# EAGLE schematic Roboteq_Board_V1.1 (EAGLE 9.6.2)
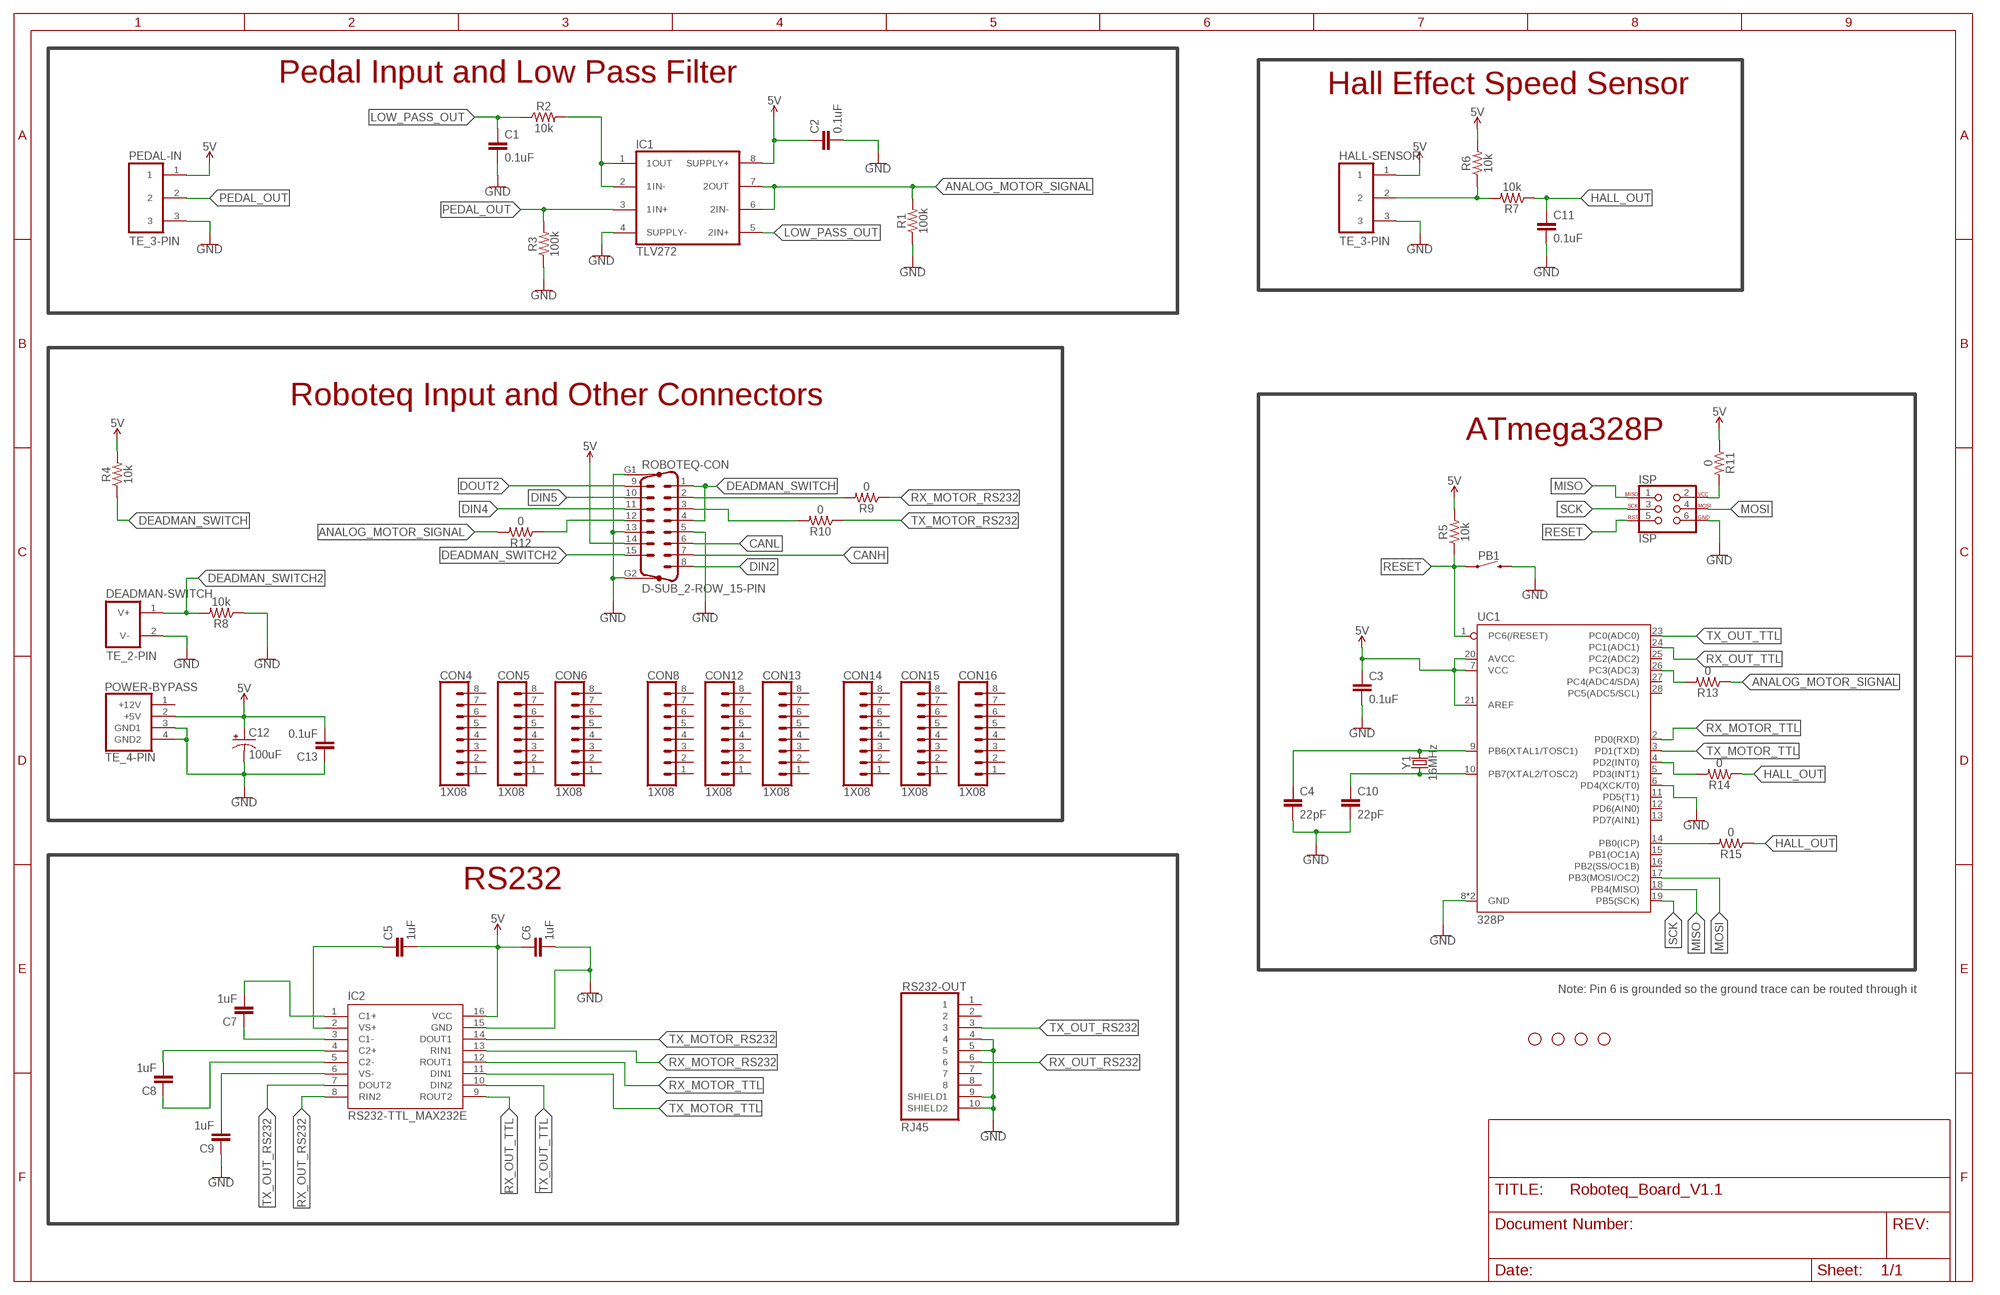
[diagram p0: schematic, sheet 1]

## Parts
C1  0.1uF  CAPACITOR_CERAMIC_THROUGH-HOLE  [CAP-PTH-5MM]
C2  0.1uF  CAPACITOR_CERAMIC_THROUGH-HOLE  [CAP-PTH-5MM]
C3  0.1uF  CAPACITOR_CERAMIC_THROUGH-HOLE  [CAP-PTH-5MM]
C4  22pF  CAPACITOR_CERAMIC_THROUGH-HOLE  [CAP-PTH-5MM]
C5  1uF  CAPACITOR_CERAMIC_THROUGH-HOLE  [CAP-PTH-5MM]
C6  1uF  CAPACITOR_CERAMIC_THROUGH-HOLE  [CAP-PTH-5MM]
C7  1uF  CAPACITOR_CERAMIC_THROUGH-HOLE  [CAP-PTH-5MM]
C8  1uF  CAPACITOR_CERAMIC_THROUGH-HOLE  [CAP-PTH-5MM]
C9  1uF  CAPACITOR_CERAMIC_THROUGH-HOLE  [CAP-PTH-5MM]
C10  22pF  CAPACITOR_CERAMIC_THROUGH-HOLE  [CAP-PTH-5MM]
C11  0.1uF  CAPACITOR_CERAMIC_THROUGH-HOLE  [CAP-PTH-5MM]
C12  100uF  CAPACITOR_ELECTROLYTIC_100UF  [CAPACITOR_100UF_50V]
C13  0.1uF  CAPACITOR_CERAMIC_THROUGH-HOLE  [CAP-PTH-5MM]
CON4  1X08  [1X08]
CON5  1X08  [1X08]
CON6  1X08  [1X08]
CON8  1X08  [1X08]
CON12  1X08  [1X08]
CON13  1X08  [1X08]
CON14  1X08  [1X08]
CON15  1X08  [1X08]
CON16  1X08  [1X08]
DEADMAN-SWITCH  TE_2-PIN  [TE_2-PIN]
H1  STAND-OFF  [STAND-OFF]
H2  STAND-OFF  [STAND-OFF]
H3  STAND-OFF  [STAND-OFF]
H4  STAND-OFF  [STAND-OFF]
HALL-SENSOR  TE_3-PIN  [TE_3-PIN]
IC1  TLV272  OP-AMP_DUAL  [DIP08]
IC2  RS232-TTL_MAX232E  [DIP16]
ISP  ISP  [ISP_CONNECTOR]
PB1  PUSHBUTTON  [PUSHBUTTON]
PEDAL-IN  TE_3-PIN  [TE_3-PIN]
POWER-BYPASS  TE_4-PIN  [TE_4-PIN]
R1  100k  RESISTOR_THROUGH-HOLE_1/4W  [AXIAL-0.3]
R2  10k  RESISTOR_THROUGH-HOLE_1/4W  [AXIAL-0.3]
R3  100k  RESISTOR_THROUGH-HOLE_1/4W  [AXIAL-0.3]
R4  10k  RESISTOR_THROUGH-HOLE_1/4W  [AXIAL-0.3]
R5  10k  RESISTOR_THROUGH-HOLE_1/4W  [AXIAL-0.3]
R6  10k  RESISTOR_THROUGH-HOLE_1/4W  [AXIAL-0.3]
R7  10k  RESISTOR_THROUGH-HOLE_1/4W  [AXIAL-0.3]
R8  10k  RESISTOR_THROUGH-HOLE_1/4W  [AXIAL-0.3]
R9  0  RESISTOR_THROUGH-HOLE_1/4W  [AXIAL-0.3]
R10  0  RESISTOR_THROUGH-HOLE_1/4W  [AXIAL-0.3]
R11  0  RESISTOR_THROUGH-HOLE_1/4W  [AXIAL-0.3]
R12  0  RESISTOR_THROUGH-HOLE_1/4W  [AXIAL-0.3]
R13  0  RESISTOR_THROUGH-HOLE_1/4W  [AXIAL-0.3]
R14  0  RESISTOR_THROUGH-HOLE_1/4W  [AXIAL-0.3]
R15  0  RESISTOR_THROUGH-HOLE_1/4W  [AXIAL-0.3]
ROBOTEQ-CON  D-SUB_2-ROW_15-PIN  [D-SUB_2-ROW_15-PIN]
RS232-OUT  RJ45  [RJ45]
UC1  328P  ATMEGA328P_DIP28  [DIP28]
Y1  16MHz  CRYSTAL-16MHZPTH-HC49US  [HC49US]

## Nets
5V: C2.1 C3.1 C5.2 C6.1 C12.+ C13.2 HALL-SENSOR.1 IC1.8(SUPPLY+) IC2.16(VCC) PEDAL-IN.1 POWER-BYPASS.2(+5V) R4.P$2 R5.P$2 R6.P$2 R11.P$1 ROBOTEQ-CON.14 UC1.7(VCC) UC1.20(AVCC) UC1.21(AREF)
ANALOG_MOTOR_SIGNAL: IC1.6(2IN-) IC1.7(2OUT) R1.P$2 R12.P$2 R13.P$1
CANH: ROBOTEQ-CON.7
CANL: ROBOTEQ-CON.6
DEADMAN_SWITCH: R4.P$1 ROBOTEQ-CON.1 ROBOTEQ-CON.4
DEADMAN_SWITCH2: DEADMAN-SWITCH.1(V+) R8.P$2 ROBOTEQ-CON.15
DIN2: ROBOTEQ-CON.8
DIN4: ROBOTEQ-CON.11
DIN5: ROBOTEQ-CON.10
DOUT2: ROBOTEQ-CON.9
GND: C1.2 C2.2 C3.2 C4.2 C6.2 C9.1 C10.2 C11.2 C12.- C13.1 DEADMAN-SWITCH.2(V-) HALL-SENSOR.3 IC1.4(SUPPLY-) IC2.15(GND) ISP.6 PB1.3 PB1.4 PEDAL-IN.3 POWER-BYPASS.3(GND1) POWER-BYPASS.4(GND2) R1.P$1 R3.P$1 R8.P$1 ROBOTEQ-CON.5 ROBOTEQ-CON.13 ROBOTEQ-CON.G1(GND1) ROBOTEQ-CON.G2(GND2) RS232-OUT.4 RS232-OUT.5 RS232-OUT.9(SHIELD1) RS232-OUT.10(SHIELD2) UC1.6(PD4(XCK/T0)) UC1.8(GND) UC1.22(GND)
HALL_OUT: C11.1 R7.P$1 R14.P$1 R15.P$1
LOW_PASS_OUT: C1.1 IC1.5(2IN+) R2.P$1
MISO: ISP.1 UC1.18(PB4(MISO))
MOSI: ISP.4 UC1.17(PB3(MOSI/OC2))
N$1: R9.P$2 ROBOTEQ-CON.2
N$2: IC1.1(1OUT) IC1.2(1IN-) R2.P$2
N$3: R13.P$2 UC1.26(PC3(ADC3))
N$4: C4.1 UC1.9(PB6(XTAL1/TOSC1)) Y1.2
N$5: C10.1 UC1.10(PB7(XTAL2/TOSC2)) Y1.1
N$6: C7.2 IC2.1(C1+)
N$7: C5.1 IC2.2(VS+)
N$8: C7.1 IC2.3(C1-)
N$9: C8.2 IC2.4(C2+)
N$10: C8.1 IC2.5(C2-)
N$11: C9.2 IC2.6(VS-)
N$12: HALL-SENSOR.2 R6.P$1 R7.P$2
N$13: R10.P$2 ROBOTEQ-CON.3
N$14: ISP.2 R11.P$2
N$15: R12.P$1 ROBOTEQ-CON.12
N$16: R14.P$2 UC1.4(PD2(INT0))
N$17: R15.P$2 UC1.14(PB0(ICP))
PEDAL_OUT: IC1.3(1IN+) PEDAL-IN.2 R3.P$2
RESET: ISP.5 PB1.1 PB1.2 R5.P$1 UC1.1(PC6(/RESET))
RX_MOTOR_RS232: IC2.13(RIN1) R9.P$1
RX_MOTOR_TTL: IC2.12(ROUT1) UC1.2(PD0(RXD))
RX_OUT_RS232: IC2.8(RIN2) RS232-OUT.6
RX_OUT_TTL: IC2.9(ROUT2) UC1.24(PC1(ADC1))
SCK: ISP.3 UC1.19(PB5(SCK))
TX_MOTOR_RS232: IC2.14(DOUT1) R10.P$1
TX_MOTOR_TTL: IC2.11(DIN1) UC1.3(PD1(TXD))
TX_OUT_RS232: IC2.7(DOUT2) RS232-OUT.3
TX_OUT_TTL: IC2.10(DIN2) UC1.23(PC0(ADC0))
Unconnected: CON4.1 CON4.2 CON4.3 CON4.4 CON4.5 CON4.6 CON4.7 CON4.8 CON5.1 CON5.2 CON5.3 CON5.4 CON5.5 CON5.6 CON5.7 CON5.8 CON6.1 CON6.2 CON6.3 CON6.4 CON6.5 CON6.6 CON6.7 CON6.8 CON8.1 CON8.2 CON8.3 CON8.4 CON8.5 CON8.6 CON8.7 CON8.8 CON12.1 CON12.2 CON12.3 CON12.4 CON12.5 CON12.6 CON12.7 CON12.8 CON13.1 CON13.2 CON13.3 CON13.4 CON13.5 CON13.6 CON13.7 CON13.8 CON14.1 CON14.2 CON14.3 CON14.4 CON14.5 CON14.6 CON14.7 CON14.8 CON15.1 CON15.2 CON15.3 CON15.4 CON15.5 CON15.6 CON15.7 CON15.8 CON16.1 CON16.2 CON16.3 CON16.4 CON16.5 CON16.6 CON16.7 CON16.8 POWER-BYPASS.1(+12V) RS232-OUT.1 RS232-OUT.2 RS232-OUT.7 RS232-OUT.8 UC1.5(PD3(INT1)) UC1.11(PD5(T1)) UC1.12(PD6(AIN0)) UC1.13(PD7(AIN1)) UC1.15(PB1(OC1A)) UC1.16(PB2(SS/OC1B)) UC1.25(PC2(ADC2)) UC1.27(PC4(ADC4/SDA)) UC1.28(PC5(ADC5/SCL))

## Notes on the sheet
- Pedal Input and Low Pass Filter
- Hall Effect Speed Sensor
- Roboteq Input and Other Connectors
- ATmega328P
- RS232
- Note: Pin 6 is grounded so the ground trace can be routed through it

## Library data of the parts
C1-C11 C13 = EcoCar-Passives:CAPACITOR_CERAMIC_THROUGH-HOLE
C12 = EcoCar-Passives:CAPACITOR_ELECTROLYTIC_100UF: 50V 100uF Electrolytic Capacitor Manufacturer: Nichicon Series: UVZ Part Number: UVZ1H101MPD1TD Digikey Part Number: 493-13464-1-ND
CON4-CON6 CON8 CON12-CON16 = EcoCar-Connectors-2.54mm:1X08: 2.54mm (0.1") Header
DEADMAN-SWITCH = EcoCar-Connectors:TE_2-PIN: 2 Pin TE Mini-Universal MATE-N-LOK - Use for signals and power connections Part Number: 1-770966-0 Digikey Part Number: A32471-ND Matching Plug: A25587-ND Matching Crimps: A100828CT-ND
H1-H4 = EcoCar-Miscellaneous:STAND-OFF: Stand Off Drill holes for mechanically mounting via screws, standoffs, etc. Note: Use the keepout ring to avoid running the screw head into surrounding components. Variant Overviews STAND-OFF - Mechanical footprint for a #4 phillips button head screw. STAND-OFF-TIGHT - Mechanical footprint for a #4 phillips button head screw, Example SparkFun Products Screw - Phillips Head (1/4", 4-40, 10 pack) <https://www.sparkfun.com/products/10453> (PRT-10453) Screw - Phillips Head (1/2", 4-40, 10 pack) <https://www.sparkfun.com/products/10452> (PRT-10452) Screw - Phillips Head (3/4", 4-40, 10 pack) <https://www.sparkfun.com/products/10451> (PRT-10451) Screw - Phillips Head (1", 4-40, 10 pack) <https://www.sparkfun.com/products/10450> (PRT-10450)
HALL-SENSOR PEDAL-IN = EcoCar-Connectors:TE_3-PIN: 3 Pin TE Mini-Universal MATE-N-LOK Part Number: 1-770967-0 Digikey Part Number: A32473-ND Matching Plug: A25588-ND Matching Crimps: A100828CT-ND
IC1 = EcoCar-Integrated-Circuits:OP-AMP_DUAL
IC2 = EcoCar-Integrated-Circuits:RS232-TTL_MAX232E: Dual 5V TTL to RS-232 Converter Manufacturer: Texas Instruments Part Number: MAX232EIN Digikey Part Number: 296-27963-5-ND
ISP = EcoCar-Microcontrollers:ISP: ISP Header Use for programming microcontrollers such as the 328P
PB1 = EcoCar-Electromechanical:PUSHBUTTON: Pushbutton Manufacturer: TE Connectivity ALCOSWITCH Switches Part Number: 1825910-6 Digikey Part Number: 450-1650-ND
POWER-BYPASS = EcoCar-Connectors:TE_4-PIN: 4 Pin TE Mini-Universal MATE-N-LOK - Use for 12V and 5V connections Part Number: 1-770968-0 Digikey Part Number: A32474-ND Matching Plug: A25571-ND Matching Crimps: A100828CT-ND
R1-R15 = EcoCar-Passives:RESISTOR_THROUGH-HOLE_1/4W
ROBOTEQ-CON = EcoCar-Connectors:D-SUB_2-ROW_15-PIN: 15 Pin D-SUB for Roboteq Motor Controller Female Connector Part: AE10931-ND
RS232-OUT = EcoCar-Connectors:RJ45: RJ45 Connector - Use for signals and low power connections Unshielded Part Number: RJHSE-5080 Unshielded Digikey Part Number: RJHSE-5080-ND Shielded Part Number: RJHSE5E80 Shielded Digikey Part Number: RJHSE5E80-ND
UC1 = EcoCar-Microcontrollers:ATMEGA328P_DIP28: ATmega328P Manufacturer: Microchip Part Number: ATMEGA328P-PU Digikey Part Number: ATMEGA328P-PU-ND; PROD_ID: IC-09136
Y1 = EcoCar-Microcontrollers:CRYSTAL-16MHZ: 16MHz Crystal Oscillator Manufacturer: TXC Part Number: 9B-16.000MBBK-B Digikey Part Number: 887-2015-ND; PROD_ID: XTAL-08181; SF_ID: COM-00536